# Altium schematic sheet regulator.SchDoc
size A4; SheetNumber: 4; SheetTotal: 4
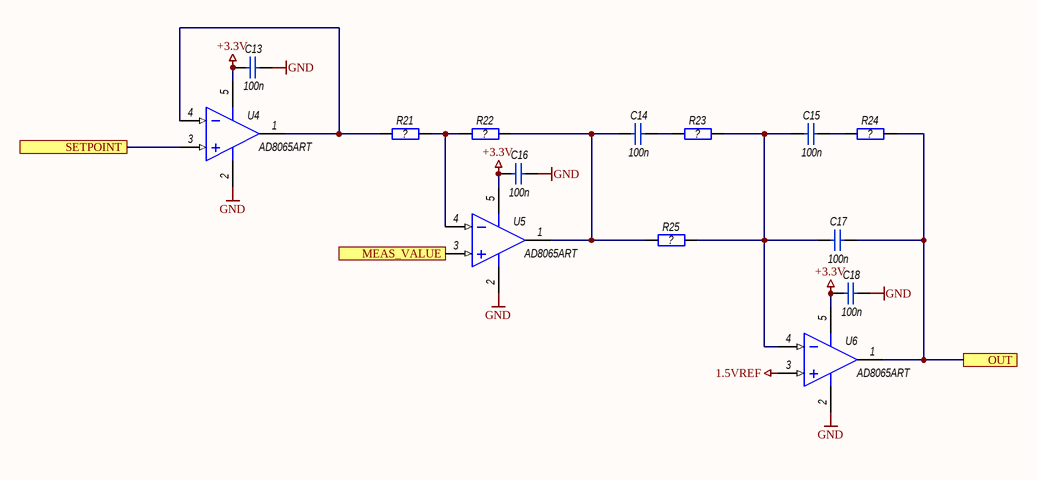
[diagram p0: regulator.SchDoc]

## Parts
C13  100n  [CAP_0805]
C14  100n  [CAP_0805]
C15  100n  [CAP_0805]
C16  100n  [CAP_0805]
C17  100n  [CAP_0805]
C18  100n  [CAP_0805]
R21  ?  [RES_0805]
R22  ?  [RES_0805]
R23  ?  [RES_0805]
R24  ?  [RES_0805]
R25  ?  [RES_0805]
U4  AD8065ART  [sot235]
U5  AD8065ART  [sot235]
U6  AD8065ART  [sot235]

## Ports
MEAS_VALUE, OUT, SETPOINT

## Nets
1.5VREF: U6.3(IN+)
+3.3V: C13.1 C16.1 C18.1 U4.5(V+) U5.5(V+) U6.5(V+)
GND: C13.2 C16.2 C18.2 U4.2(V-) U5.2(V-) U6.2(V-)
MEAS_VALUE: U5.3(IN+) ; port MEAS_VALUE
OUT: C17.2 R24.2 U6.1(OUT) ; port OUT
SETPOINT: U4.3(IN+) ; port SETPOINT
NetC14_1: C14.1 R22.2 R25.1 U5.1(OUT)
NetC14_2: C14.2 R23.1
NetC15_1: C15.1 C17.1 R23.2 R25.2 U6.4(IN-)
NetC15_2: C15.2 R24.1
NetR21_1: R21.1 U4.1(OUT) U4.4(IN-)
NetR21_2: R21.2 R22.1 U5.4(IN-)

## Library data of the parts
C13-C18 = Capacitor: Конденсатор
R21-R25 = Resisitor: Резистор
U4-U6 = OPAMP SOT235: Операционный усилитель